# Altium schematic sheet Cap_Volt_Convert.SchDoc
size A4; SheetNumber: 2; SheetTotal: 3
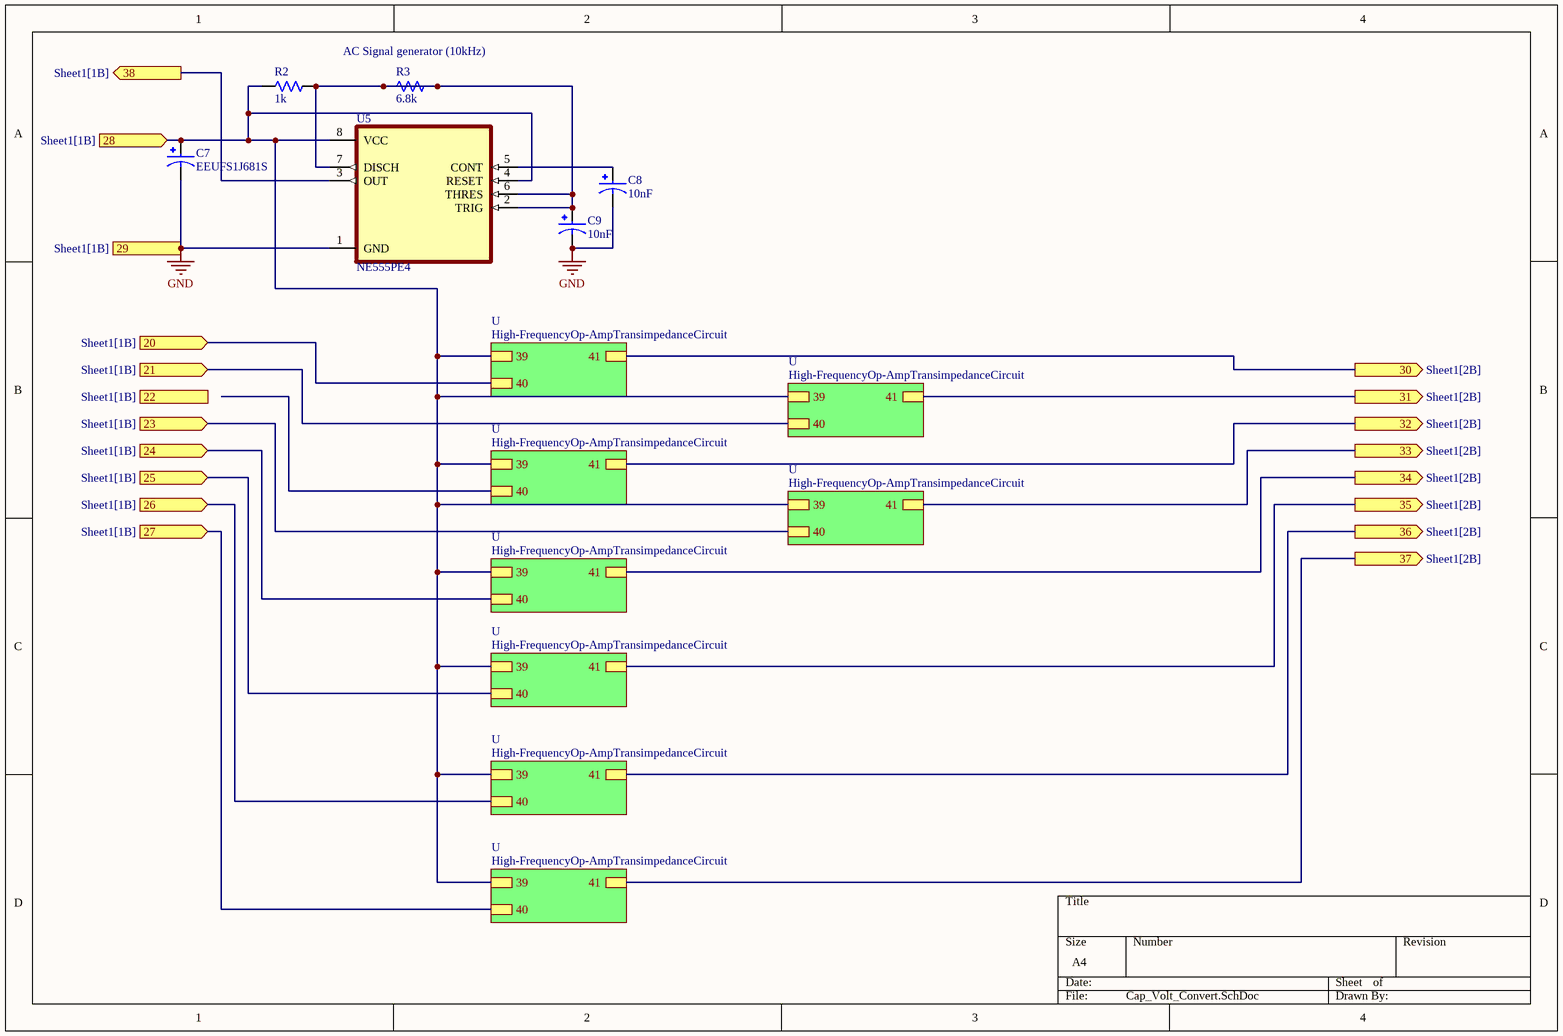
[diagram p0: Cap_Volt_Convert.SchDoc]

## Parts
C7  EEUFS1J681S  [CAPPRD750W80D1600H2000]
C8  10nF  [CAPPRD750W80D1600H2000]
C9  10nF  [CAPPRD750W80D1600H2000]
R2  1k  [RESAD730W45L370D210]
R3  6.8k  [RESAD730W45L370D210]
U5  NE555PE4  [DIP794W45P254L959H508Q8]

## Sub-sheets
U = High-FrequencyOp-AmpTransimpedanceCircuit: 39, 40, 41
U = High-FrequencyOp-AmpTransimpedanceCircuit: 39, 40, 41
U = High-FrequencyOp-AmpTransimpedanceCircuit: 39, 40, 41
U = High-FrequencyOp-AmpTransimpedanceCircuit: 39, 40, 41
U = High-FrequencyOp-AmpTransimpedanceCircuit: 39, 40, 41
U = High-FrequencyOp-AmpTransimpedanceCircuit: 39, 40, 41
U = High-FrequencyOp-AmpTransimpedanceCircuit: 39, 40, 41
U = High-FrequencyOp-AmpTransimpedanceCircuit: 39, 40, 41

## Ports
20 (in, see Sheet1[1B]), 21 (in, see Sheet1[1B]), 22 (in, see Sheet1[1B]), 23 (in, see Sheet1[1B]), 24 (in, see Sheet1[1B]), 25 (in, see Sheet1[1B]), 26 (in, see Sheet1[1B]), 27 (in, see Sheet1[1B]), 28 (in, see Sheet1[1B]), 29 (in, see Sheet1[1B]), 30 (out, see Sheet1[2B]), 31 (out, see Sheet1[2B]), 32 (out, see Sheet1[2B]), 33 (out, see Sheet1[2B]), 34 (out, see Sheet1[2B]), 35 (out, see Sheet1[2B]), 36 (out, see Sheet1[2B]), 37 (out, see Sheet1[2B]), 38 (out, see Sheet1[1B])

## Nets
GND: C7.N C8.N C9.N U5.1(GND) ; port 29
20: port 20, sheet U/40
21: port 21, sheet U/40
23: port 23, sheet U/40
24: port 24, sheet U/40
25: port 25, sheet U/40
26: port 26, sheet U/40
27: port 27, sheet U/40
28: C7.P R2.2 U5.4(RESET) U5.8(VCC) ; port 28, sheet U/39, sheet U/39, sheet U/39, sheet U/39, sheet U/39, sheet U/39, sheet U/39, sheet U/39
30: port 30, sheet U/41
31: port 31, sheet U/41
32: port 32, sheet U/41
33: port 33, sheet U/41
34: port 34, sheet U/41
35: port 35, sheet U/41
36: port 36, sheet U/41
37: port 37, sheet U/41
38: U5.3(OUT) ; port 38
NetC8_P: C8.P U5.5(CONT)
NetC9_P: C9.P R2.1 R3.1 R3.2 U5.2(TRIG) U5.6(THRES) U5.7(DISCH)

## Notes on the sheet
- (near R3) AC Signal generator (10kHz)

## Library data of the parts
C7-C9 = EEUFS1J681S: CAP ALUM 680UF 20% 63V THRU HOLE; MP: EEU-FS1J681S; MF: Panasonic Electronic Components; Package: RADIAL-2 Panasonic; Availability: In Stock; SnapEDA_Link: https://www.snapeda.com/parts/EEU-FS1J681S/Panasonic/view-part/5562022/?ref=snap; Price: None; Check_prices: https://www.snapeda.com/parts/EEU-FS1J681S/Panasonic/view-part/5562022/?ref=eda; Value: *
R2 R3 = MFR-12FTE52-12K5: Metal Film Resistors - Through Hole; MF: YAGEO; SnapEDA_Link: https://www.snapeda.com/parts/MFR-12FTE52-12K5/Yageo/view-part/?ref=snap; Package: RADIAL-2 Yageo; Value: *; MP: MFR-12FTE52-12K5; Check_prices: https://www.snapeda.com/parts/MFR-12FTE52-12K5/Yageo/view-part/?ref=eda
U5 = NE555PE4: Single Precision Timer; MF: Texas Instruments; SnapEDA_Link: https://www.snapeda.com/parts/NE555PE4/Texas+Instruments/view-part/?ref=snap; Package: PDIP-8 Texas; Value: *; MP: NE555PE4; Check_prices: https://www.snapeda.com/parts/NE555PE4/Texas+Instruments/view-part/?ref=eda